# Altium schematic sheet sensor_wifi.SchDoc
size A3; SheetNumber: 6; SheetTotal: 6
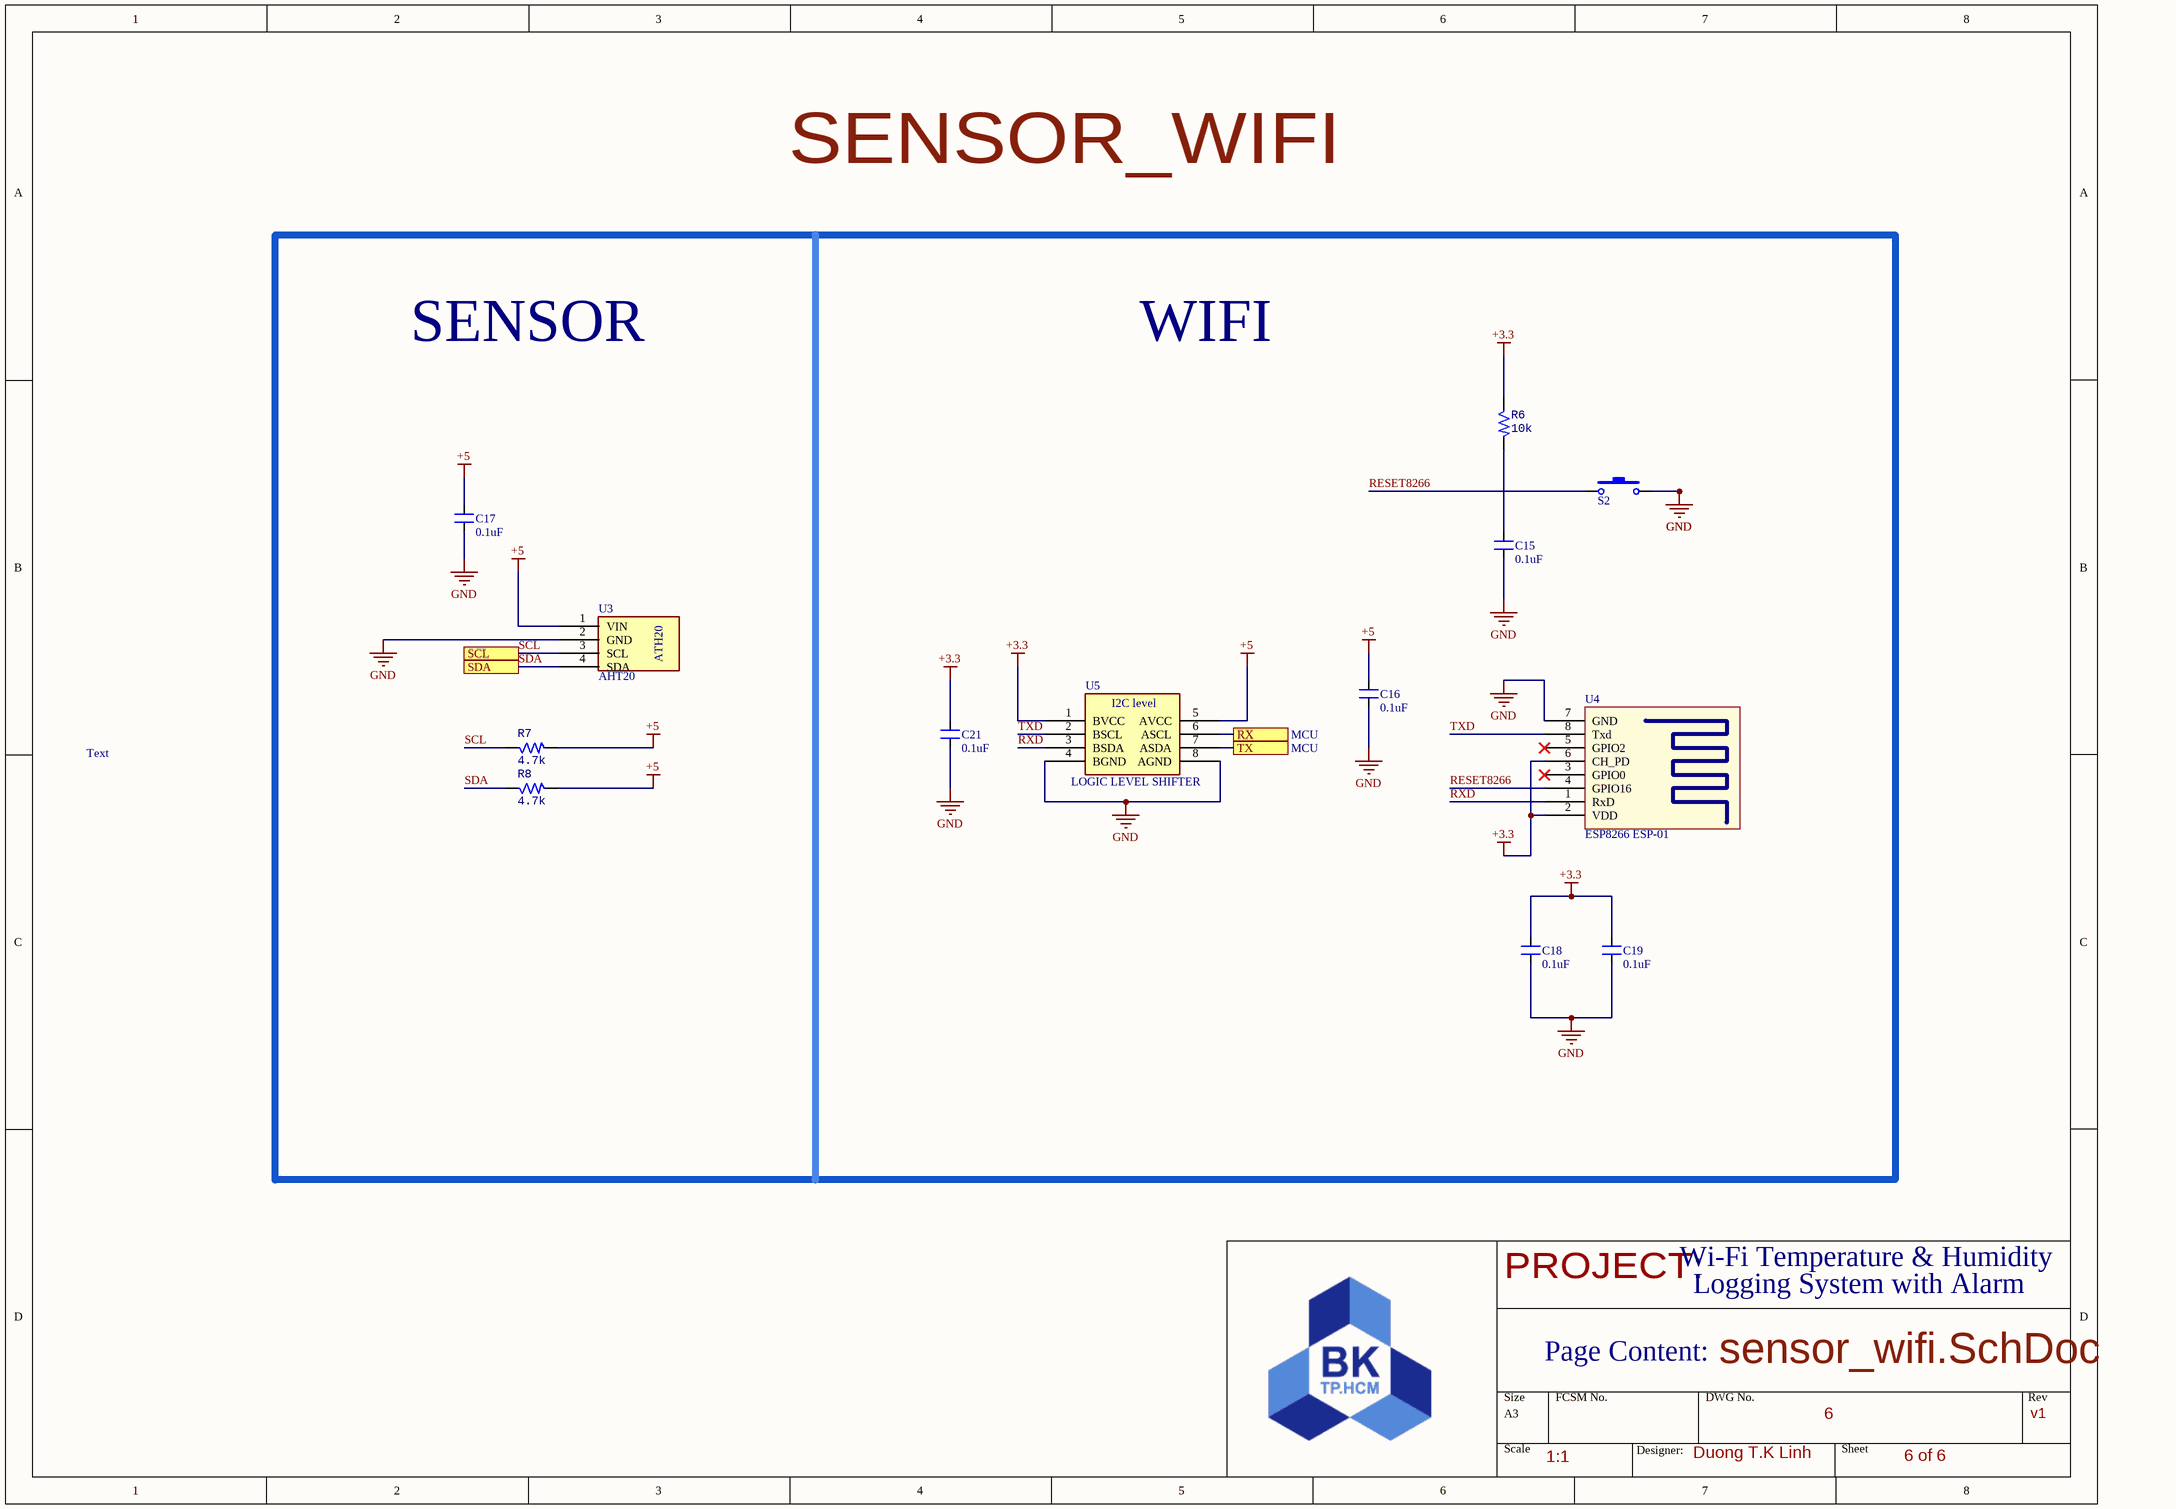
[diagram p0: sensor_wifi.SchDoc]

## Parts
C15  0.1uF  [CN2]
C16  0.1uF  [CN2]
C17  0.1uF  [CN2]
C18  0.1uF  [CN2]
C19  0.1uF  [CN2]
C21  0.1uF  [CN2]
R6  10k  [RES-1/4W-SMALL]
R7  4.7k  [RES-1/4W-SMALL]
R8  4.7k  [RES-1/4W-SMALL]
S2  RESET_WIFI  [BUTTON  ROUND]  (value not drawn)
U3  AHT20  [AHT20]
U4  ESP8266 ESP-01  [ESP8266 ESP-01]
U5  LOGIC LEVEL SHIFTER  [I2C LEVEL]

## Ports
RX (see MCU), SCL (see MCU), SDA (see MCU), TX (see MCU)

## Nets
+3.3: C18.2 C19.2 C21.2 R6.1 U4.2(VDD) U4.6(CH_PD) U5.1(BVCC)
+5: C16.2 C17.2 R7.2 R8.2 U3.1(VIN) U5.5(AVCC)
GND: C15.1 C16.1 C17.1 C18.1 C19.1 C21.1 S2.2 U3.2(GND) U4.7(GND) U5.4(BGND) U5.8(AGND)
RESET8266: S2.1 U4.4(GPIO16)
RX: U5.6(ASCL) ; port RX
RXD: U4.1(RxD) U5.3(BSDA)
SCL: R7.1 U3.3(SCL) ; port SCL
SDA: R8.1 U3.4(SDA) ; port SDA
TX: U5.7(ASDA) ; port TX
TXD: U4.8(Txd) U5.2(BSCL)
NetC15_2: C15.2 R6.2

Not connected (* = marked no-connect by the designer): U4 3(GPIO0)* 5(GPIO2)*

## Notes on the sheet
- SENSOR_WIFI
- SENSOR
- WIFI
- Text
- PROJECT:
- Wi-Fi Temperature & Humidity
- Logging System with Alarm
- Page Content:
- sensor_wifi.SchDoc
- 1:1
- Designer:
- Duong T.K Linh
- 6
- 6 of 6
- v1
- (in symbol i2c level) I2C level

## Library data of the parts
C15-C19 C21 = CN2: Cap np 104 => 105pF; Value: 0.1uF
R6-R8 = RES-SMD
S2 = SW-Button: Switch-Button; Published: 24-Mar-1999; LatestRevisionDate: 17-Jul-2002; LatestRevisionNote: Re-released for DXP Platform.; PackageReference: SPST-2; Publisher: Altium Limited
U3 = ATH20
U5 = i2c level